# Altium schematic sheet Teensy 3.6 with J1939 - Handheld Rev3a.SchDoc: Secure Handheld J1939 Logger
size Letter; Author: Dr. Jeremy Daily; CompanyName: The University of Tulsa; Organization: Mechanical Engineering; Address1: 800 S. Tucker Dr.; Address2: Tulsa, OK 74104; DocumentNumber: Hands-On Heavy Duty Networking; Revision: 3a; SheetNumber: 1; SheetTotal: 2
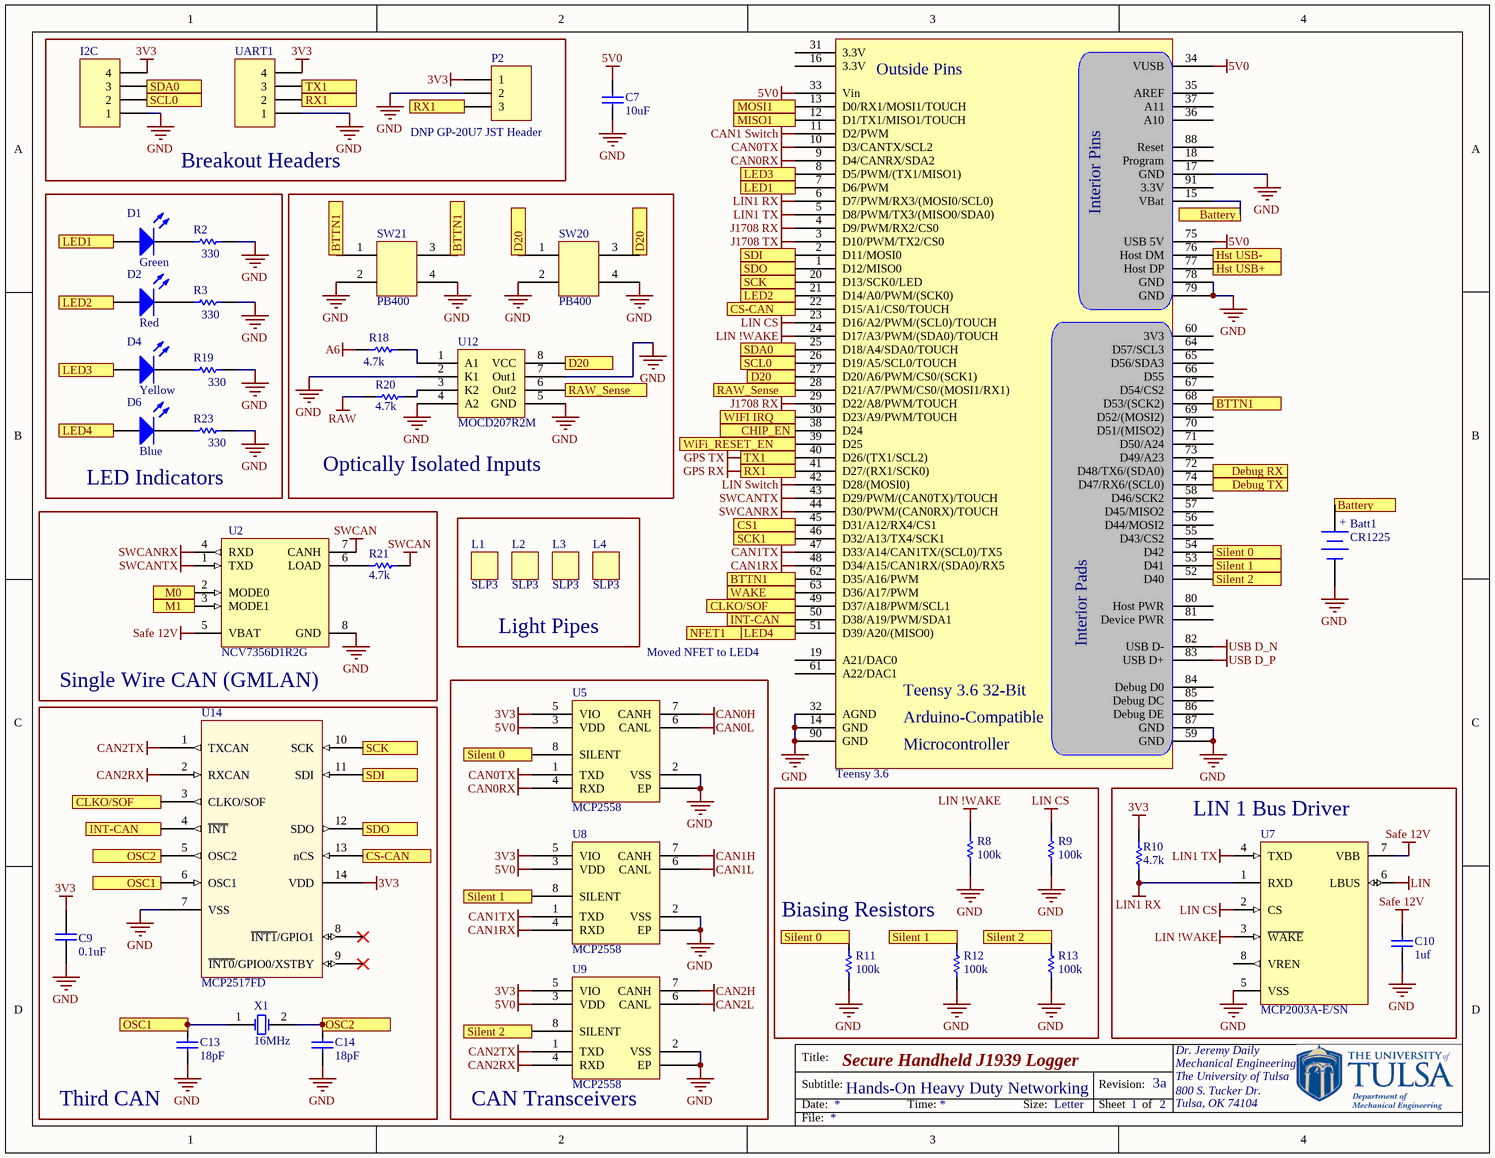
[diagram p0: Teensy 3.6 with J1939 - Handheld Rev3a.SchDoc]

## Parts
Batt1  CR1225  [Battery Clip - CR1225]
C7  10uF  [0603]
C9  0.1uF  [0603]
C10  1uf  [0603]
C13  18pF  [0603]
C14  18pF  [0603]
D1  Green  [0805 Polarized]
D2  Red  [0805 Polarized]
D4  Yellow  [0805 Polarized]
D6  Blue  [0805 Polarized]
I2C  Header 4  [HDR1X4]  (value not drawn)
L1  SLP3  [PCBComponent_1]
L2  SLP3  [PCBComponent_1]
L3  SLP3  [PCBComponent_1]
L4  SLP3  [PCBComponent_1]
P2  DNP GP-20U7 JST Header  [MHDR1X3]
R2  330  [0603]
R3  330  [0603]
R8  100k  [0603]
R9  100k  [0603]
R10  4.7k  [0603]
R11  100k  [0603]
R12  100k  [0603]
R13  100k  [0603]
R18  4.7k  [0603]
R19  330  [0603]
R20  4.7k  [0603]
R21  4.7k  [0603]
R23  330  [0603]
SW20  PB400  [PB400]
SW21  PB400  [PB400]
Teensy_3.6  Teensy 3.6  [Teensy 3.6 Surface Mount]  (value not drawn)
U2  NCV7356D1R2G  [ONSC-SOIC-8-751-07_V]
U5  MCP2558  [TDFN]
U7  MCP2003A-E/SN  [SOIC-SN8_N]
U8  MCP2558  [TDFN]
U9  MCP2558  [TDFN]
U12  MOCD207R2M  [SOIC-8]
U14  MCP2517FD  [SOP14]
UART1  Header 4  [HDR1X4]  (value not drawn)
X1  16MHz  [XTAL 2 pad]

## Blocks framed on the sheet
Breakout Headers: I2C P2 UART1
LED Indicators: D1 D2 D4 D6 R2 R3 R19 R23
Optically Isolated Inputs: R18 R20 SW20 SW21 U12
Single Wire CAN (GMLAN): R21 U2
Light Pipes: L1-L4
CAN Transceivers: U5 U8 U9
Third CAN: C9 C13 C14 U14 X1
Biasing Resistors: R8 R9 R11-R13
LIN 1 Bus Driver: C10 R10 U7

## Ports
Battery, BTTN1, CHIP_EN, CLKO/SOF, CS1, CS-CAN, D20, Debug RX, Debug TX, Hst USB+, Hst USB-, INT-CAN, LED1, LED2, LED3, LED4, M0, M1, MISO1, MOSI1, NFET1, OSC1, OSC2, RAW_Sense, RX1, SCK, SCK1, SCL0, SDA0, SDI, SDO, Silent 0, Silent 1, Silent 2, TX1, WAKE, WIFI IRQ, WiFi_RESET_EN

## Nets
3V3: C9.2 I2C.4 P2.1 R10.2 U5.5(VIO) U8.5(VIO) U9.5(VIO) U14.14(VDD) UART1.4
5V0: C7.1 Teensy_3.6.33(Vin) Teensy_3.6.34(VUSB) Teensy_3.6.75(USB_5V) U5.3(VDD) U8.3(VDD) U9.3(VDD)
A6: R18.1
CAN0H: U5.7(CANH)
CAN0L: U5.6(CANL)
CAN0RX: Teensy_3.6.9(D4/CANRX/SDA2) U5.4(RXD)
CAN0TX: Teensy_3.6.10(D3/CANTX/SCL2) U5.1(TXD)
CAN1 Switch: Teensy_3.6.11(D2/PWM)
CAN1H: U8.7(CANH)
CAN1L: U8.6(CANL)
CAN1RX: Teensy_3.6.48(D34/A15/CAN1RX/(SDA0)/RX5) U8.4(RXD)
CAN1TX: Teensy_3.6.47(D33/A14/CAN1TX/(SCL0)/TX5) U8.1(TXD)
CAN2H: U9.7(CANH)
CAN2L: U9.6(CANL)
CAN2RX: U9.4(RXD) U14.2(RXCAN)
CAN2TX: U9.1(TXD) U14.1(TXCAN)
GND: Batt1.2(-) C7.2 C9.1 C10.2 C13.1 C14.1 I2C.1 P2.2 R2.2 R3.2 R8.2 R9.2 R11.2 R12.2 R13.2 R19.2 R23.2 SW20.2 SW20.4 SW21.2 SW21.4 Teensy_3.6.14(GND) Teensy_3.6.17(GND) Teensy_3.6.32(AGND) Teensy_3.6.59(GND) Teensy_3.6.78(GND) Teensy_3.6.79(GND) Teensy_3.6.87(GND) Teensy_3.6.90(GND) U2.8(GND) U5.0(EP) U5.2(VSS) U7.5(VSS) U8.0(EP) U8.2(VSS) U9.0(EP) U9.2(VSS) U12.2(K1) U12.4(A2) U12.5(GND) U12.7(Out1) U14.7(VSS) UART1.1
GPS RX: P2.3 Teensy_3.6.41(D27/(RX1/SCK0)) UART1.2 ; port RX1
GPS TX: Teensy_3.6.40(D26/(TX1/SCL2)) UART1.3 ; port TX1
J1708 RX: Teensy_3.6.4(D9/PWM/RX2/CS0) Teensy_3.6.29(D22/A8/PWM/TOUCH)
J1708 TX: Teensy_3.6.3(D10/PWM/TX2/CS0)
LIN: U7.6(LBUS)
LIN1 RX: R10.1 Teensy_3.6.6(D7/PWM/RX3/(MOSI0/SCL0)) U7.1(RXD)
LIN1 TX: Teensy_3.6.5(D8/PWM/TX3/(MISO0/SDA0)) U7.4(TXD)
LIN !WAKE: R8.1 Teensy_3.6.24(D17/A3/PWM/(SDA0)/TOUCH) U7.3(~{WAKE})
LIN CS: R9.1 Teensy_3.6.23(D16/A2/PWM/(SCL0)/TOUCH) U7.2(CS)
LIN Switch: Teensy_3.6.42(D28/(MOSI0))
RAW: R20.1
Safe 12V: C10.1 U2.5(VBAT) U7.7(VBB)
SWCAN: R21.2 U2.7(CANH)
SWCANRX: Teensy_3.6.44(D30/PWM/(CAN0RX)/TOUCH) U2.4(RXD)
SWCANTX: Teensy_3.6.43(D29/PWM/(CAN0TX)/TOUCH) U2.1(TXD)
USB D_N: Teensy_3.6.82(USB_D-)
USB D_P: Teensy_3.6.83(USB_D+)
Battery: Batt1.1(+) Teensy_3.6.15(VBat) ; port Battery
BTTN1: SW21.1 SW21.3 Teensy_3.6.62(D35/A16/PWM) Teensy_3.6.68(D53/(SCK2)) ; port BTTN1
CHIP_EN: Teensy_3.6.38(D24) ; port CHIP_EN
CLKO/SOF: Teensy_3.6.49(D37/A18/PWM/SCL1) U14.3(CLKO/SOF) ; port CLKO/SOF
CS1: Teensy_3.6.45(D31/A12/RX4/CS1) ; port CS1
CS-CAN: Teensy_3.6.22(D15/A1/CS0/TOUCH) U14.13(nCS) ; port CS-CAN
D20: SW20.1 SW20.3 Teensy_3.6.27(D20/A6/PWM/CS0/(SCK1)) U12.8(VCC) ; port D20
Debug RX: Teensy_3.6.72(D48/TX6/(SDA0)) ; port Debug RX
Debug TX: Teensy_3.6.74(D47/RX6/(SCL0)) ; port Debug TX
Hst USB+: Teensy_3.6.77(Host_DP) ; port Hst USB+
Hst USB-: Teensy_3.6.76(Host_DM) ; port Hst USB-
INT-CAN: Teensy_3.6.50(D38/A19/PWM/SDA1) U14.4(~{INT}) ; port INT-CAN
LED1: D1.1(A) Teensy_3.6.7(D6/PWM) ; port LED1
LED2: D2.1(A) Teensy_3.6.21(D14/A0/PWM/(SCK0)) ; port LED2
LED3: D4.1(A) Teensy_3.6.8(D5/PWM/(TX1/MISO1)) ; port LED3
LED4: D6.1(A) Teensy_3.6.51(D39/A20/(MISO0)) ; port LED4, port NFET1
M0: U2.2(MODE0) ; port M0
M1: U2.3(MODE1) ; port M1
MISO1: Teensy_3.6.12(D1/TX1/MISO1/TOUCH) ; port MISO1
MOSI1: Teensy_3.6.13(D0/RX1/MOSI1/TOUCH) ; port MOSI1
OSC1: C13.2 U14.6(OSC1) X1.1(OSC1) ; port OSC1
OSC2: C14.2 U14.5(OSC2) X1.2(OSC2) ; port OSC2
RAW_Sense: Teensy_3.6.28(D21/A7/PWM/CS0/(MOSI1/RX1)) U12.6(Out2) ; port RAW_Sense
SCK: Teensy_3.6.20(D13/SCK0/LED) U14.10(SCK) ; port SCK
SCK1: Teensy_3.6.46(D32/A13/TX4/SCK1) ; port SCK1
SCL0: I2C.2 Teensy_3.6.26(D19/A5/SCL0/TOUCH) ; port SCL0
SDA0: I2C.3 Teensy_3.6.25(D18/A4/SDA0/TOUCH) ; port SDA0
SDI: Teensy_3.6.2(D11/MOSI0) U14.11(SDI) ; port SDI
SDO: Teensy_3.6.1(D12/MISO0) U14.12(SDO) ; port SDO
Silent 0: R11.1 Teensy_3.6.54(D42) U5.8(SILENT) ; port Silent 0
Silent 1: R12.1 Teensy_3.6.53(D41) U8.8(SILENT) ; port Silent 1
Silent 2: R13.1 Teensy_3.6.52(D40) U9.8(SILENT) ; port Silent 2
WAKE: Teensy_3.6.63(D36/A17/PWM) ; port WAKE
WIFI IRQ: Teensy_3.6.30(D23/A9/PWM/TOUCH) ; port WIFI IRQ
WiFi_RESET_EN: Teensy_3.6.39(D25) ; port WiFi_RESET_EN
NetD1_2: D1.2(K) R2.1
NetD2_2: D2.2(K) R3.1
NetD4_2: D4.2(K) R19.1
NetD6_2: D6.2(K) R23.1
NetR18_2: R18.2 U12.1(A1)
NetR20_2: R20.2 U12.3(K2)
NetR21_1: R21.1 U2.6(LOAD)

Not connected (* = marked no-connect by the designer): Teensy_3.6 16(3.3V) 18(Program) 19(A21/DAC0) 31(3.3V) 35(AREF) 36(A10) 37(A11) 55(D43/CS2) 56(D44/MOSI2) 57(D45/MISO2) 58(D46/SCK2) 60(3V3) 61(A22/DAC1) 64(D57/SCL3) 65(D56/SDA3) 66(D55) 67(D54/CS2) 69(D52/(MOSI2)) 70(D51/(MISO2)) 71(D50/A24) 73(D49/A23) 80(Host_PWR) 81(Device_PWR) 84(Debug_D0) 85(Debug_DC) 86(Debug_DE) 88(Reset) 91(3.3V); U7 8(VREN); U14 8(~{INT1}/GPIO1)* 9(~{INT0}/GPIO0/XSTBY)*

## Notes on the sheet
- Moved NFET to LED4
- Title:
- Subtitle:
- Date:
- Time:
- Size:
- Letter
- Revision:
- Sheet
- of
- File:
- (in symbol Teensy 3.6) Outside Pins; Interior Pins; Interior Pads; Teensy 3.6 32-Bit; Arduino-Compatible; Microcontroller

## Library data of the parts
Batt1 = CR2032 Battery Holder: Lithium Battery Non-Rechargeable (Primary) 3V Coin, 12.5mm; Manufacturer: Linx; PartNumber: BAT-HLD-012-SMT; Supplier 1: Digi-Key; Supplier Part Number 1: BAT-HLD-012-SMT-ND
C7 = Cap: 10µF ±20% 25V Ceramic Capacitor X5R 0603 (1608 Metric); Manufacturer: Murata Electronics North America; PartNumber: ZRB18AR61E106ME01L; Supplier 1: Digi-Key; Supplier Part Number 1: 490-10991-1-ND
C9 = Cap: CAP CER 0.1UF 50V X7R 0603; Manufacturer: KEMET; PartNumber: C0603C104K5RACAUTO; Supplier 1: Digi-Key; Supplier Part Number 1: 399-6856-1-ND
C10 = Cap: 1µF ±20% 50V Ceramic Capacitor X5R 0603 (1608 Metric); Manufacturer: Murata Electronics North America; PartNumber: GRT188R61H105ME13D; Supplier 1: Digi-Key; Supplier Part Number 1: 490-12331-1-ND
C13 C14 = Cap: 18pF ±5% 50V Ceramic Capacitor C0G, NP0 0603 (1608 Metric); Manufacturer: Kemet; PartNumber: C0603C180J5GACAUTO; Supplier 1: Digi-Key; Supplier Part Number 1: 399-16019-1-ND
D1 = LED - SMD: Green 570nm LED Indication - Discrete 2.2V 0805 (2012 Metric); Manufacturer: OSRAM Opto Semiconductors Inc.; PartNumber: LG R971-KN-1; Supplier 1: Digi-Key; Supplier Part Number 1: 475-1410-1-ND
D2 = LED - SMD: Red 633nm LED Indication - Discrete 2V 0805 (2012 Metric); Manufacturer: OSRAM Opto Semiconductors Inc.; PartNumber: LS R976-NR-1; Supplier 1: Digi-Key; Supplier Part Number 1: 475-1278-1-ND
D4 = LED - SMD: LED YELLOW DIFFUSED 0805 SMD; Manufacturer: OSRAM Opto Semiconductors Inc.; PartNumber: LY R976-PS-36; Supplier 1: Digi-Key; Supplier Part Number 1: 475-2560-1-ND
D6 = LED - SMD: Blue 470nm LED Indication - Discrete 3.3V 0805 (2012 Metric); Manufacturer: Broadcom Limited; PartNumber: HSMN-C170; Supplier 1: Digi-Key; Supplier Part Number 1: 516-1437-1-ND
I2C UART1 = Header 4: Header, 4-Pin
L1-L4 = SLP3: Manufacturer: Bivar Inc.; PartNumber: SLP3-150-250-R; Supplier 1: Digi-Key; Supplier Part Number 1: 492-2517-ND
P2 = MHDR1X3: CONN HEADER PH SIDE 3POS 2MM SMD; PartNumber: S3B-PH-SM4-TB(LF)(SN); Manufacturer: JST; Supplier 1: Digi-Key; Supplier Part Number 1: 455-1750-1-ND
R2 R3 R19 R23 = Chip Resistor: 330 Ohms ±1% 0.1W, 1/10W Chip Resistor 0603 (1608 Metric) Automotive AEC-Q200, High Voltage Thick Film; Manufacturer: Rohm Semiconductor; PartNumber: KTR03EZPF3300; Supplier 1: Digi-Key; Supplier Part Number 1: RHM330AYCT-ND
R8 R9 R11-R13 = Chip Resistor: ±1% 0.1W, 1/10W Chip Resistor 0603 (1608 Metric) Automotive AEC-Q200, High Voltage Thick Film; Manufacturer: Rohm Semiconductor; PartNumber: KTR03EZPF1003; Supplier 1: Digi-Key; Supplier Part Number 1: RHM100KAYCT-ND
R10 R18 R20 R21 = Chip Resistor: ±1% 0.1W, 1/10W Chip Resistor 0603 (1608 Metric) Automotive AEC-Q200, High Voltage Thick Film; Manufacturer: Rohm Semiconductor; PartNumber: KTR03EZPF4701; Supplier 1: Digi-Key; Supplier Part Number 1: RHM4.7KAYCT-ND
SW20 SW21 = PB400: Pushbutton Switch DPST-NO Standard Through Hole, Right Angle; Manufacturer: E-Switch; PartNumber: PB400OAQR1BLK; Supplier 1: Digi-Key; Supplier Part Number 1: EG5548-ND
Teensy_3.6 = Teensy 3.6: K66 Teensy 3.6 Kinetis MCU 32-Bit ARM® Cortex®-M4 Embedded Evaluation Board; Manufacturer: PRJC; PartNumber: Teensy 3.6; Supplier 1: Digi-Key; Supplier Part Number 1: 1568-1442-ND
U2 = NCV7356D1G: Single Wire CAN Transceiver, 5 to 27 V, 8-Pin SOIC, Pb-Free, Tube; Manufacturer: On Semiconductor; Supplier 1: Digi-Key; Supplier Part Number 1: NCV7356D1R2GOSCT-ND; PartNumber: NCV7356D1R2G
U5 = MCP2558FD: Microchip CAN FD Transceiver with Silent Mode; Manufacturer: Microchip Technology; PartNumber: MCP2558FDT-H/MNY; Supplier 1: Digi-Key; Supplier Part Number 1: MCP2558FDT-H/MNYCT-ND
U7 = MCP2003AT-E/SN: LIN J2602 Transceiver, 8-Pin SOIC, Extended Temperature, Tape and Reel; Manufacturer: Microchip Technology; Supplier 1: Digi-Key; Supplier Part Number 1: MCP2003A-E/SN-ND; PartNumber: MCP2003A-E/SN
U8 U9 = MCP2558FD: Microchip CAN FD Transceiver with Silent Mode; PartNumber: MCP2558FDT-H/MNY; Manufacturer: Microchip; Supplier 1: Digi-Key; Supplier Part Number 1: MCP2558FDT-H/MNYCT-ND
U12 = Optoisolator - Dual: Optoisolator Transistor Output 2500Vrms 2 Channel 8-SO Tall; Manufacturer: Fairchild/ON Semiconductor; PartNumber: MOCD207R2M; Supplier 1: Digi-Key; Supplier Part Number 1: MOCD207R2MCT-ND
U14 = MCP2517FD: CANbus Controller CAN 2.0 SPI Interface 14-VDFN (4.5x3); Manufacturer: Microchip Technology; PartNumber: MCP2517FDT-H/JHA; Supplier 1: Digi-Key; Supplier Part Number 1: MCP2517FDT-H/JHACT-ND
X1 = Crystal Oscillator: CRYSTAL 16MHZ 18PF SMD; Manufacturer: TXC CORPORATION; PartNumber: 7A-16.000MAAJ-T; Supplier 1: Digi-Key; Supplier Part Number 1: 887-1086-1-ND